# Altium schematic sheet MCU.SchDoc
size A4; SheetNumber: 5; SheetTotal: 7
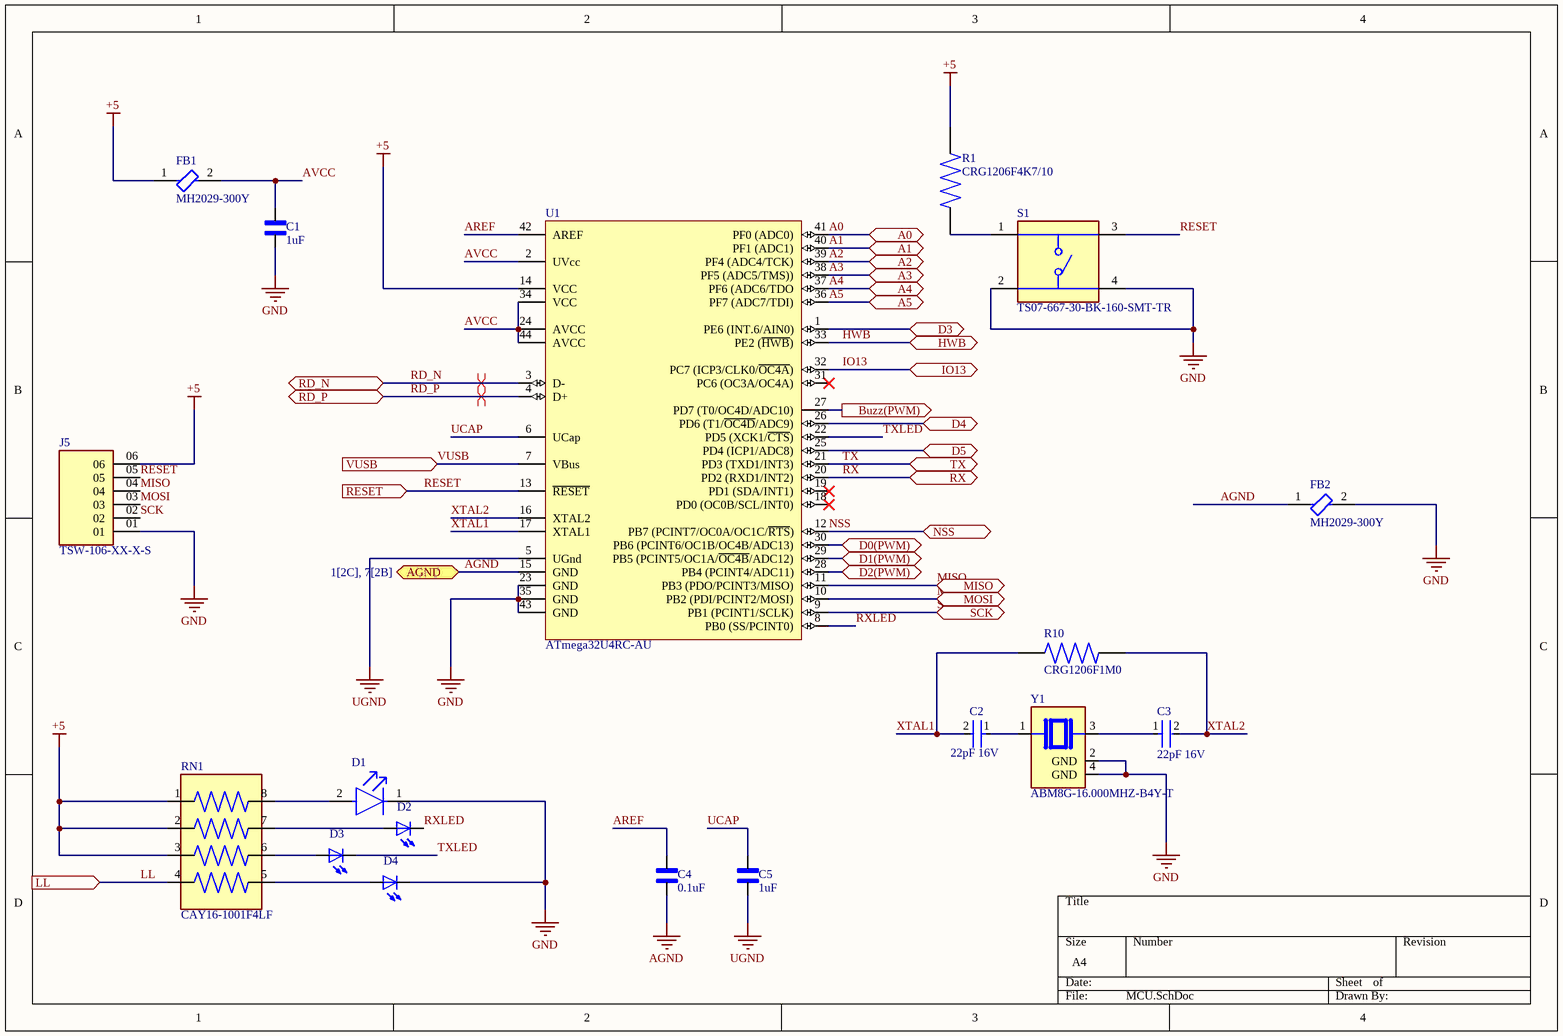
[diagram p0: MCU.SchDoc]

## Parts
C1  1uF  [CAPC1608X90N]
C2  22pF 16V  [FP-C0603C-CF-MFG]
C3  22pF 16V  [FP-C0603C-CF-MFG]
C4  0.1uF  [CAPC1608X90]
C5  1uF  [CAPC1608X90N]
D1  LTST-C171KGKT  [FP-LTST-C171KGKT-MFG]  (value not drawn)
D2  LTST-C171KSKT  [DIOC200X125X110]  (value not drawn)
D3  LTST-C171KSKT  [DIOC200X125X110]  (value not drawn)
D4  LTST-C171KSKT  [DIOC200X125X110]  (value not drawn)
FB1  MH2029-300Y  [FP-MH2029-IPC_A]
FB2  MH2029-300Y  [FP-MH2029-IPC_A]
J5  TSW-106-XX-X-S  [SAMTEC_TSW-106-XX-X-S]
R1  CRG1206F4K7/10  [RESC3115X65N]
R10  CRG1206F1M0  [RESC3115X65N]
RN1  CAY16-1001F4LF  [RESCAF80P320X160X60-8N]
S1  TS07-667-30-BK-160-SMT-TR  [SW_TS07-667-30-BK-160-SMT-TR]
U1  ATmega32U4RC-AU  [44ML_N]
Y1  ABM8G-16.000MHZ-B4Y-T  [XTAL_ABM8G-16.000MHZ-B4Y-T]

## Ports
A0 (bidir, see 1[2B], 2[1A]), A1 (bidir, see 1[2B], 2[1A]), A2 (bidir, see 1[2B], 2[1A]), A3 (bidir, see 1[2B], 2[1A]), A4 (bidir, see 1[2B], 2[1A]), A5 (bidir, see 1[2B], 2[1B]), AGND (bidir, see 1[2C], 7[2B]), Buzz(PWM) (out, see 1[2B], 2[2C]), D0(PWM) (bidir, see 1[2B], 2[1B]), D1(PWM) (bidir, see 1[2B], 2[1B]), D2(PWM) (bidir, see 1[2B], 2[1B]), D3 (bidir, see 1[2B], 2[1B]), D4 (bidir, see 1[2B], 2[1B]), D5 (bidir, see 1[2B], 2[1B]), HWB (bidir, see 1[2B], 6[1D]), IO13 (bidir, see 1[2C], 6[1C]), LL (in, see 1[2B], 6[4A]), MISO (bidir, see 1[3C], 4[2C]), MOSI (bidir, see 1[3C], 4[4B]), NSS (bidir, see 1[3C], 4[2B]), RD_N (bidir, see 1[2C], 7[1B]), RD_P (bidir, see 1[2C], 7[1C]), RESET (in, see 1[2C], 6[1D]), RX (bidir, see 1[3B], 4[4D]), SCK (bidir, see 1[3C], 4[4C]), TX (bidir, see 1[3B], 4[2D]), VUSB (in, see 1[2C], 6[1B], 7[3B])

## Nets
+5: FB1.1 J5.06 R1.2 RN1.1 RN1.2 RN1.3 U1.14(VCC)
AGND: C4.2 FB2.1 U1.15(GND) ; port AGND
GND: C1.1 D1.1(C) D4.NEG FB2.2 J5.01 S1.2 S1.4 U1.23(GND) U1.35(GND) U1.43(GND) Y1.2(GND) Y1.4(GND)
UGND: C5.1 U1.5(UGnd)
A0: U1.41(PF0_(ADC0)) ; port A0
A1: U1.40(PF1_(ADC1)) ; port A1
A2: U1.39(PF4_(ADC4/TCK)) ; port A2
A3: U1.38(PF5_(ADC5/TMS))) ; port A3
A4: U1.37(PF6_(ADC6/TDO) ; port A4
A5: U1.36(PF7_(ADC7/TDI)) ; port A5
AREF: C4.1 U1.42(AREF)
AVCC: C1.2 FB1.2 U1.2(UVcc) U1.24(AVCC) U1.34(VCC) U1.44(AVCC)
Buzz(PWM): U1.27(PD7_(T0/OC4D/ADC10)) ; port Buzz(PWM)
D0(PWM): U1.30(PB6_(PCINT6/OC1B/OC4B/ADC13)) ; port D0(PWM)
D1(PWM): U1.29(PB5_(PCINT5/OC1A/~{OC4B}/ADC12)) ; port D1(PWM)
D2(PWM): U1.28(PB4_(PCINT4/ADC11)) ; port D2(PWM)
D3: U1.1(PE6_(INT.6/AIN0)) ; port D3
D4: U1.26(PD6_(T1/~{OC4D}/ADC9)) ; port D4
D5: U1.25(PD4_(ICP1/ADC8)) ; port D5
HWB: U1.33(PE2_(~{HWB})) ; port HWB
IO13: U1.32(PC7_(ICP3/CLK0/~{OC4A})) ; port IO13
LL: RN1.4 ; port LL
MISO: J5.04 U1.11(PB3_(PDO/PCINT3/MISO)) ; port MISO
MOSI: J5.03 U1.10(PB2_(PDI/PCINT2/MOSI)) ; port MOSI
NSS: U1.12(PB7_(PCINT7/OC0A/OC1C/~{RTS})) ; port NSS
RD_N: U1.3(D-) ; port RD_N
RD_P: U1.4(D+) ; port RD_P
RESET: J5.05 S1.3 U1.13(~{RESET}) ; port RESET
RX: U1.20(PD2_(RXD1/INT2)) ; port RX
RXLED: D2.NEG U1.8(PB0_(SS/PCINT0))
SCK: J5.02 U1.9(PB1_(PCINT1/SCLK)) ; port SCK
TX: U1.21(PD3_(TXD1/INT3)) ; port TX
TXLED: D3.NEG U1.22(PD5_(XCK1/~{CTS}))
UCAP: C5.2 U1.6(UCap)
VUSB: U1.7(VBus) ; port VUSB
XTAL1: C2.2 R10.1 U1.17(XTAL1)
XTAL2: C3.2 R10.2 U1.16(XTAL2)
NetC2_1: C2.1 Y1.1
NetC3_1: C3.1 Y1.3
NetD1_2: D1.2(A) RN1.8
NetD2_POS: D2.POS RN1.7
NetD3_POS: D3.POS RN1.6
NetD4_POS: D4.POS RN1.5
NetR1_1: R1.1 S1.1

Not connected (* = marked no-connect by the designer): U1 18(PD0_(OC0B/SCL/INT0))* 19(PD1_(SDA/INT1))* 31(PC6_(OC3A/OC4A))*

## Layout directives
differential pair; differential pair class RD: RD_N, RD_P

## Library data of the parts
C1 C5 = C0603C105K4RAC7411: Multilayer Ceramic Capacitors MLCC / SMD/SMT Multilayer Ceramic / Capacitors MLCC  SMD/SMT 16V / 1uF X7R 0603 10%; Package: None; Price: None; Value: *; MP: C0603C105K4RAC7411; Availability: Unavailable
C2 C3 = CMP-03020-008075-1: CAP CER 22PF 50V X7R 0603 / C0603C220K5RACTU; Manufacturer: KEMET; Material: Ceramic; Tolerance: 0.1; Automotive Grade: Grade 1; Temperature Coefficient: 30ppm/°C; Temperature Range Low: -55°C; Voltage Rating: 50 V; Category: Cap; Lead Free: Yes; Height: 0.87mm; Manufacturer Part Number: C0603C220K5RACTU; RoHS: TRUE; ComponentLink2Description: Datasheet; Capacitance: 22 pF; Package: C0603C-CF; Temperature: -55°C to +125°C; Value: 22 pF; ComponentLink2URL: https://api.kemet.com/component-edge/download/datasheet/C0603C100J5GACAUTO.pdf; Device Class L2: Capacitors; Octopart: https://octopart.com/c0603c220k5ractu-kemet-77776654; Device Class L1: Passive Components; Temperature Characteristic: X7R; Digikey Description: CAP CER 22PF 50V X7R 0603; Automotive: Yes; Device Class L3: Ceramic Capacitors; Temperature Range High: +125°C; Mouser Description: Cap Ceramic 22pF 50V X7R 10% Pad SMD 0603 125C T/R
C4 = C0603C104J4RACTU: Capacitor;Ceramic;Cap;.0.1uF;Tol+5%;SMT;Vol-Rtg 16V;X7R;TR | KEMET C0603C104J4RACTU; SnapEDA_Link: https://www.snapeda.com/parts/C0603C104J4RACTU/KEMET/view-part/?ref=snap; Package: 603-2 KEMET; Value: *; MF: KEMET; MP: C0603C104J4RACTU; Check_prices: https://www.snapeda.com/parts/C0603C104J4RACTU/KEMET/view-part/?ref=eda
D1 = CMP-22017-000037-1: LED GREEN CLEAR SMD; Number of LEDs: 1; Viewing Angle: 130°; Lens Style: Rectangular; Dominant Wavelength: 571nm; Test Current: 20mA; Luminous Intensity: 35mcd; Power Rating: 75mW; Forward Voltage: 2.4V; Forward Current: 30mA; Reverse Voltage: 5V; Lens Color: Colorless; Wavelength: 574nm; Height: 0.8mm; Illumination Color: Green; Length: 2mm; Case/Package: 0805; Number of Pins: 2; Number of Elements: 1; Package Quantity: 1; Depth: 1.25mm; Lens Transparency: Clear; Width: 1.25mm; Color: Green; Radiation Hardening: No; Mount: Surface Mount; Packaging: Tape and Reel; Case Code (Metric): 2012; Lead Free: Lead Free; Max Operating Temperature: 85°C; Min Operating Temperature: -55°C; Case Code (Imperial): 0805; Power Dissipation: 75mW
D2-D4 = LTST-C171KSKT: Yellow 587nm LED Indication - Discrete 2V 0805 (2012 Metric); MF: Lite-On Inc.; SnapEDA_Link: https://www.snapeda.com/parts/LTST-C171KSKT/Lite-On/view-part/?ref=snap; Package: 0805 Lite-On; Value: *; MP: LTST-C171KSKT; Check_prices: https://www.snapeda.com/parts/LTST-C171KSKT/Lite-On/view-part/?ref=eda
FB1 FB2 = CMP-07252-000001-1: FERRITE BEAD 30 OHM 0805 1LN; Manufacturer: Bourns; Series Resistance: 25mΩ; Resistance: 30Ω; Value: 30Ω; Impedance At Frequency: 30Ω @ 100MHz; Rms Current: 3A; Tolerance: 25%; RoHS: TRUE; Manufacturer Part Number: MH2029-300Y; Temperature Range High: +125°C; Device Class L3: Ferrite Beads and Chips; Core Material: Ferrite; ComponentLink2Description: Datasheet; Category: FBead; Octopart: https://octopart.com/mh2029-300y-bourns-756929; Digikey Description: FERRITE BEAD 30 OHM 0805 1LN; Device Class L2: EMI / RFI Components; Lead Free: Yes; Mouser Description: Ferrite Beads 30 ohms 25% HIGH CURRENT; Automotive: No; Ipc Land Pattern Name: CAPC200120X90; Temperature: -55°C to +125°C; Device Class L1: Passive Components; Height: 1.1mm; ComponentLink2URL: https://www.bourns.com/docs/Product-Datasheets/mh.pdf; Package: MH2029; Temperature Range Low: -55°C
J5 = TSW-106-XX-X-S: Connector Header Through Hole 6 position 0.100 (2.54mm); MF: Samtec; MP: TSW-106-26-T-S; SnapEDA_Link: https://www.snapeda.com/parts/TSW-106-26-T-S/Samtec/view-part/?ref=snap; Package: None; Value: *; Check_prices: https://www.snapeda.com/parts/TSW-106-26-T-S/Samtec/view-part/?ref=eda
R1 = CRG1206F4K7/10: Res Thick Film 1206 4.7K Ohm 1% 0.25W(1/4W) Â±100ppm/C Pad SMD T/R; Power_Rating: .25 W; MF: TE Connectivity; Voltage_Rating: 200 V; SnapEDA_Link: https://www.snapeda.com/parts/CRG1206F4K7/10/TE+Connectivity/view-part/?ref=snap; Package: 1206; Resistance: 4.7K; Value: *; MP: CRG1206F4K7/10; EU_RoHS_Compliance: Compliant with Exemptions; Tolerance: 1%; Check_prices: https://www.snapeda.com/parts/CRG1206F4K7/10/TE+Connectivity/view-part/?ref=eda
R10 = CRG1206F1M0: Resistor, Thick Film, Res 1 Ohms, Pwr-Rtg 0.25 W, Tol 1%, SMT, 1206 | TE Connectivity CRG1206F1M0; Power_Rating: .25 W; Resistance: 1M; Voltage_Rating: 200 V; SnapEDA_Link: https://www.snapeda.com/parts/CRG1206F1M0/TE+Connectivity+Passive+Product/view-part/?ref=snap; Package: 1206; Value: *; MF: TE Connectivity; MP: CRG1206F1M0; EU_RoHS_Compliance: Compliant with Exemptions; Tolerance: 1%; Check_prices: https://www.snapeda.com/parts/CRG1206F1M0/TE+Connectivity+Passive+Product/view-part/?ref=eda
RN1 = CAY16-1001F4LF: Resistor,Thick Film,Networks & Arrays,1K Ohm,1%,8 Pin | Bourns CAY16-1001F4LF; SnapEDA_Link: https://www.snapeda.com/parts/CAY16-1001F4LF/Bourns/view-part/?ref=snap; Package: NON STANDARD-8 Bourns; Value: *; MF: Bourns; MP: CAY16-1001F4LF; Check_prices: https://www.snapeda.com/parts/CAY16-1001F4LF/Bourns/view-part/?ref=eda
S1 = TS07-667-30-BK-160-SMT-TR: 6 x 6.7 mm, 3 mm Actuator Height, 160 gf, Black, Surface Mount, SPST, Tactile Switch; MF: Same Sky; SnapEDA_Link: https://www.snapeda.com/parts/TS07-667-30-BK-160-SMT-TR/Same+Sky/view-part/?ref=snap; Package: None; Value: *; MP: TS07-667-30-BK-160-SMT-TR; Check_prices: https://www.snapeda.com/parts/TS07-667-30-BK-160-SMT-TR/Same+Sky/view-part/?ref=eda
U1 = CMP-0095-00580-1: 8-bit AVR Microcontroller, 2.7-5.5V, 16MHz, 32KB Flash, 1KB EEPROM, 2.5KB SRAM, USB Controller, 44-pin TQFP, Industrial Grade (-40°C to 85°C), Int RC; PackageVersion: rev.G, Jul-2007; ComponentLink1URL: http://www.atmel.com/; ComponentLink2URL: http://www.atmel.com/dyn/resources/prod_documents/doc7766.pdf; PackageReference: 44ML; ComponentLink2Description: ATmega16U4/32U4 Datasheet; PackageDescription: 44-Pin Plastic Thin Quad Flat Pack, 10 x 10 x 1.0 mm Body, 0.8 mm Pitch (TQFP); ComponentLink3URL: http://www.atmel.com/dyn/resources/prod_documents/7766S.pdf; ComponentLink1Description: Manufacturer URL; DatasheetVersion: revF, Nov-2010; ComponentLink3Description: ATmega16U4 ATmega32U4 Summary
Y1 = ABM8G-16.000MHZ-B4Y-T: 16 MHz Â±30ppm Kristal 10pF 80 Ohm 4-SMD, KurÅŸunsuz; MF: Abracon; Package: SMD-4 Abracon; Price: None; Availability: In Stock; Check_prices: https://www.snapeda.com/parts/ABM8G-16.000MHZ-B4Y-T/Abracon+LLC/view-part/?ref=eda; Purchase-URL: https://pricing.snapeda.com/search/part/ABM8G-16.000MHZ-B4Y-T/?ref=eda; MP: ABM8G-16.000MHZ-B4Y-T; SnapEDA_Link: https://www.snapeda.com/parts/ABM8G-16.000MHZ-B4Y-T/Abracon+LLC/view-part/?ref=snap; Value: *